# EAGLE design piezo-jfet-buffer-simple-2x (EAGLE 7.5.0)
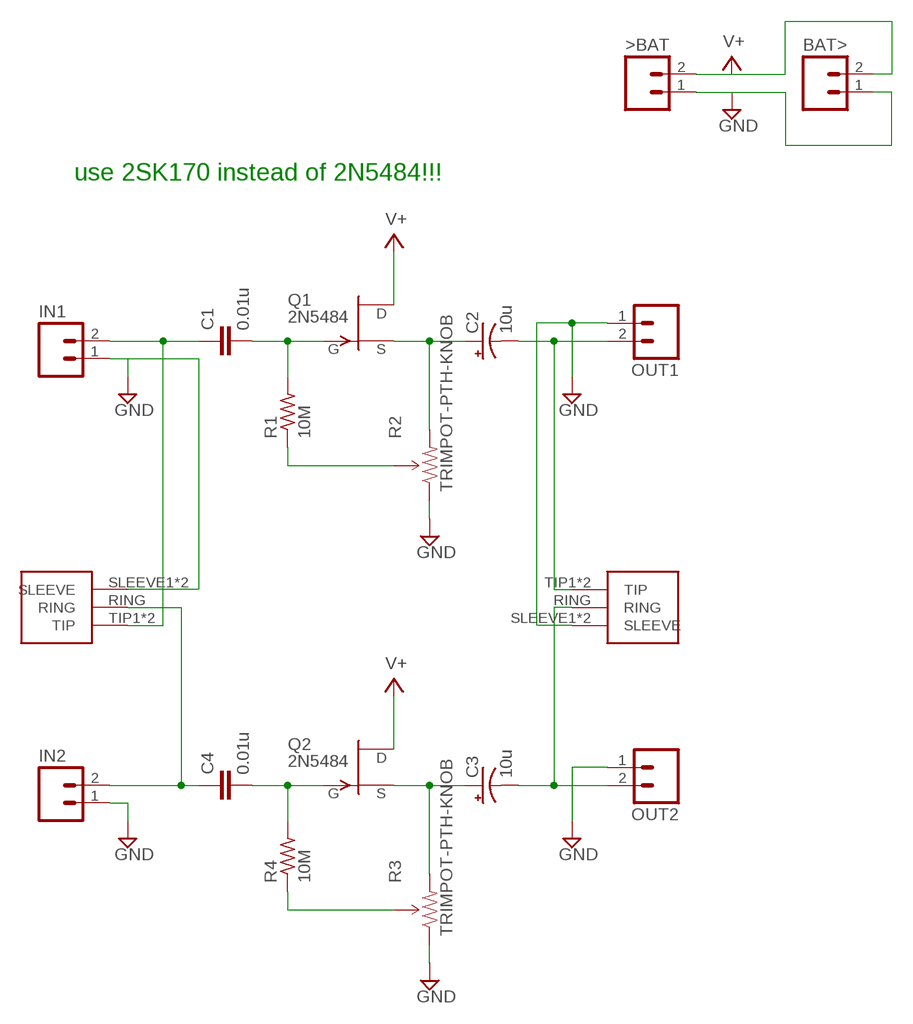
[diagram p0: schematic, sheet 1]

## Parts
>BAT  M02PTH  [1X02]
BAT>  M02PTH  [1X02]
C1  0.01u  C5/3  [C5B3]
C2  10u  CAP_POLPTH2  [CPOL-RADIAL-10UF-25V]
C3  10u  CAP_POLPTH2  [CPOL-RADIAL-10UF-25V]
C4  0.01u  C5/3  [C5B3]
IN1  M02LOCK  [1X02_LOCK]
IN2  M02LOCK  [1X02_LOCK]
OUT1  M02LOCK  [1X02_LOCK]
OUT2  M02LOCK  [1X02_LOCK]
Q1  2N5484  [TO92-]
Q2  2N5484  [TO92-]
R1  10M  R-US_0204/2V  [0204V]
R2  TRIMPOT-PTH-KNOB  [3386U]
R3  TRIMPOT-PTH-KNOB  [3386U]
R4  10M  R-US_0204/2V  [0204V]
U$1  1/8"-F-STEREO-PCB  [1/8"-F-STEREO-PCB]
U$2  1/8"-F-STEREO-PCB  [1/8"-F-STEREO-PCB]

## Nets
CH1: C2.2(-) OUT1.2 U$1.TIP1(TIP) U$1.TIP2(TIP)
CH2: C3.2(-) OUT2.2 U$1.RING
GND: >BAT.1 BAT>.1 IN1.1 IN2.1 OUT1.1 OUT2.1 R2.1(CCW) R3.1(CCW) U$1.SLEEVE1(SLEEVE) U$1.SLEEVE2(SLEEVE) U$2.SLEEVE1(SLEEVE) U$2.SLEEVE2(SLEEVE)
JFET-GATE: C1.2 Q1.1(G) R1.2
JFET-GATE1: C4.2 Q2.1(G) R4.2
JFET-SOURCE: C2.1(+) Q1.2(S) R2.3(CW)
JFET-SOURCE1: C3.1(+) Q2.2(S) R3.3(CW)
N$1: R3.2(WIPER) R4.1
N$2: C1.1 IN1.2 U$2.TIP1(TIP) U$2.TIP2(TIP)
N$3: R1.1 R2.2(WIPER)
N$4: C4.1 IN2.2 U$2.RING
V+: >BAT.2 BAT>.2 Q1.3(D) Q2.3(D)

## Notes on the sheet
- use 2SK170 instead of 2N5484!!!

## Library data of the parts
>BAT BAT> IN1 IN2 OUT1 OUT2 = SparkFun-Connectors:M02: Header 2 Standard 2-pin 0.1" header. Use with straight break away headers (SKU : PRT-00116), right angle break away headers (PRT-00553), swiss pins (PRT-00743), machine pins (PRT-00117), and female headers (PRT-00115). Molex polarized connector foot print use with SKU : PRT-08233 with associated crimp pins and housings.
C1 C4 = capacitor-wima:C: CAPACITOR naming: grid - package width
C2 C3 = SparkFun-Passives:CAP_POL: Capacitor Polarized These are standard SMD and PTH capacitors. Normally 10uF, 47uF, and 100uF in electrolytic and tantalum varieties. Always verify the external diameter of the through hole cap, it varies with capacity, voltage, and manufacturer. The EIA devices should be standard.
Q1 Q2 = transistor-fet:?548*: N-Channel JFETs Source: VISHAY 2N5484.pdf Compatible: TO92 2N5245 J304 J305 U310 J308 J309 J310 TO72 2N4416 2N4416A 2N3823 2N4351 3N169 3N170 3N171 MFE3002 TO18 2N3796 2N3797 MFE825 Source: Motorola European Master Guide Pacge 3-59
R1 R4 = resistor:R-US_: RESISTOR, American symbol
R2 R3 = SparkFun-Electromechanical:TRIMPOT: Various small potentiometers for "set-and-forget" applications
U$1 U$2 = CMU-ArtFab:1/8"-F-STEREO-PCB

## Board
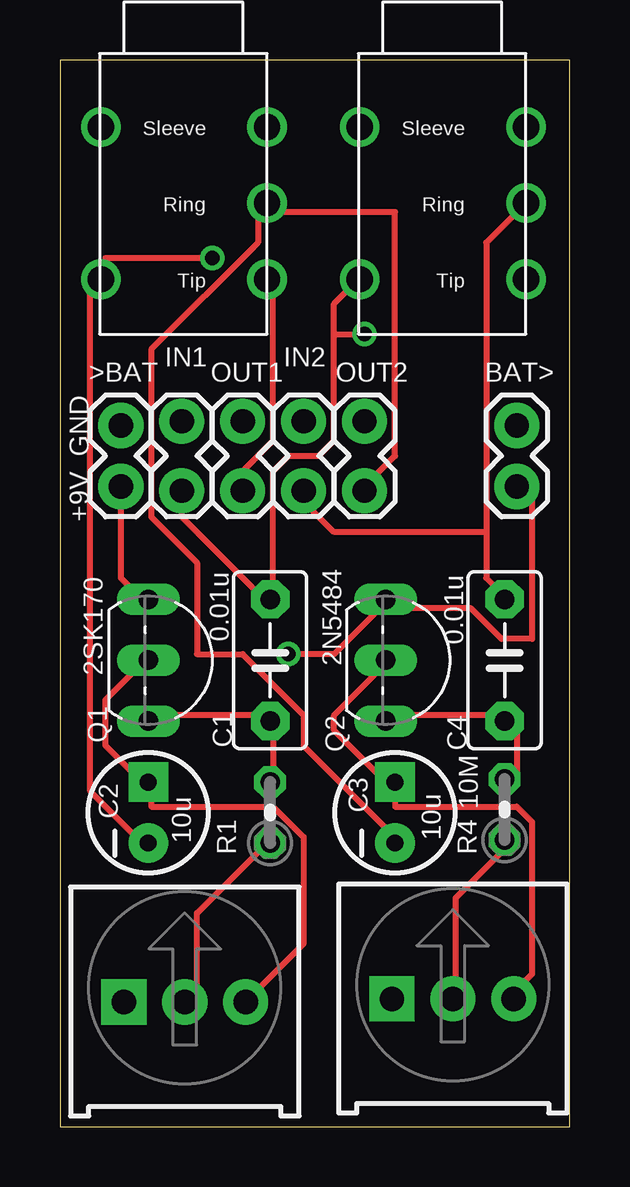
[diagram p1: board, top side]
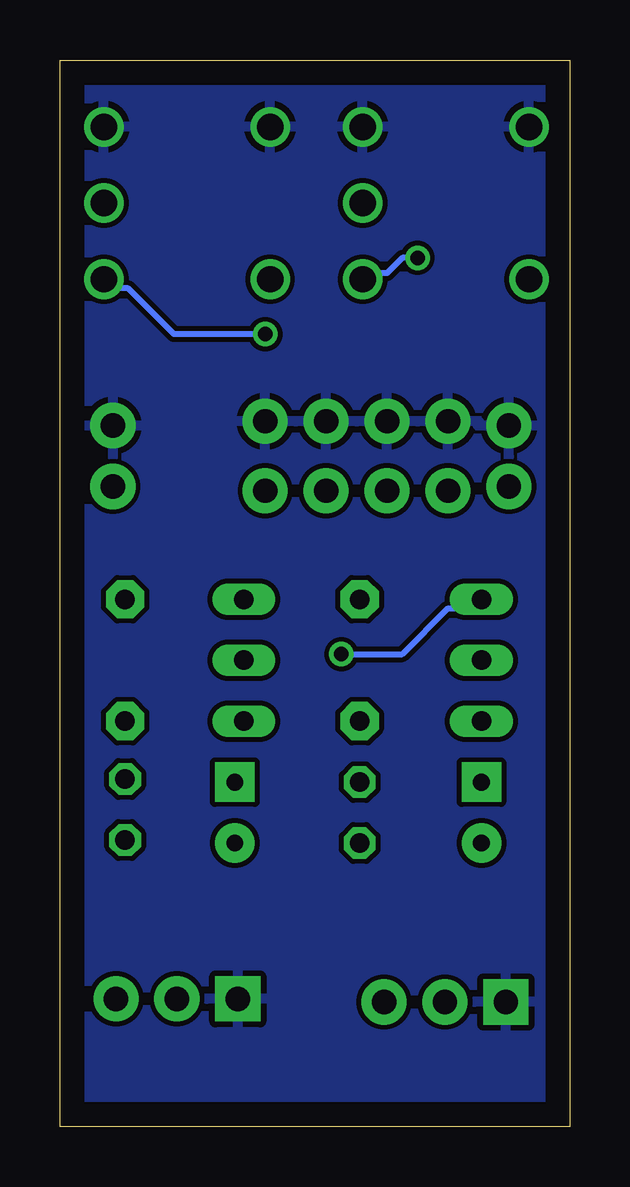
[diagram p2: board, bottom side, seen from below]

Size 21.26 x 44.44 mm. Coordinates in mm from the lower left corner, seen from the top.
Outline: 0,0 21.26,0 21.26,44.44 0,44.44 0,0
Copper layers (1*16): Top 0.035mm / dielectric 1.5mm / Bottom 0.035mm
Design rules "default": minimum track width 10mil, minimum drill 24mil, track to track 8mil, track to pad 8mil, pad to pad 8mil, via to via 8mil, smd to smd 8mil, copper to edge 40mil, drill to drill 8mil, minimum pad ring 10mil, minimum via ring 8mil, stop-mask expansion 4mil, vias tented up to drill 0mil, thermal gap 10mil

### Footprints (pad centres in the part's own frame; a part is rotated, then mirrored left to right if it is on the bottom)
1X02 = drill 1.016 pad 1.88: 1 0,0; 2 2.54,0
C5B3 = drill 0.813 pad 1.6 octagon: 1 -2.54,0; 2 2.54,0
CPOL-RADIAL-10UF-25V = drill 0.7 pad 1.651 square: 1 1.27,0 | drill 0.7 pad 1.651: 2 -1.27,0
1X02_LOCK = drill 1.016 pad 1.88: 1 -0.178,0; 2 2.718,0
TO92- = drill 0.813 long: 1 2.54,0; 2 0,0; 3 -2.54,0
0204V = drill 0.813 octagon: 1 -1.27,0; 2 1.27,0
3386U = drill 1.016 pad 1.88 square: 1 -2.54,-0.015 | drill 1.016 pad 1.88: 2 0,-0.015; 3 2.54,-0.015
1/8"-F-STEREO-PCB = drill 1.1: RING 5.461,0; SLEEVE1 8.636,6.934; SLEEVE2 8.636,0; TIP1 2.286,6.934; TIP2 2.286,0

### Placement (x,y rotation side)
>BAT  2.54,29.21 270 top
BAT>  19.05,29.21 270 top
C1  8.76,19.43 270 top
C2  3.68,13.08 90 top
C3  13.97,13.08 90 top
C4  18.54,19.43 270 top
IN1  5.08,29.21 270 top
IN2  10.16,29.21 270 top
OUT1  7.62,29.21 270 top
OUT2  12.7,29.21 270 top
Q1  3.68,19.43 270 top
Q2  13.59,19.43 270 top
R1  8.76,13.08 90 top
R2  5.21,5.21 0 top
R3  16.38,5.33 0 top
R4  18.54,13.21 90 top
U$1  8.64,33.02 90 top
U$2  19.43,33.02 90 top

### Tracks (layer width: path | path; a pad name or v marks a point on that pad's centre or on a via)
CH1  (via drill 0.61)
  Top 0.254: OUT1.2 7.62,27.3 8.89,28.57 8.89,34.92 U$1.TIP2 | C2.2 3.17,12.06 1.27,13.97 1.27,34.92 U$1.TIP1 1.91,35.56 1.91,36.2 v6.35,36.2
  Bottom 0.254: v6.35,36.2 6.99,36.2 7.62,35.56 8.26,35.56 U$1.TIP2
CH2
  Top 0.254: OUT2.2 12.7,26.67 13.97,27.94 13.97,38.1 8.89,38.1 U$1.RING 8.26,38.1 8.26,36.83 3.81,32.38 3.81,25.4 5.71,23.5 5.71,19.68 7.62,19.68 10.16,17.14 10.16,15.88 13.97,12.06 C3.2
GND
  pour Bottom: 0,44.45 21.59,44.45 21.59,0 0,0
JFET-GATE
  Top 0.254: Q1.1 3.81,17.14 8.26,17.14 C1.2 8.89,16.51 8.89,14.61 R1.2
JFET-GATE1
  Top 0.254: Q2.1 13.97,17.14 18.41,17.14 C4.2 19.05,16.51 19.05,14.61 R4.2
JFET-SOURCE
  Top 0.254: Q1.2 3.17,19.05 1.91,17.78 1.91,15.88 3.17,14.61 C2.1 3.81,13.97 3.81,13.34 8.89,13.34 10.16,12.06 10.16,7.62 8.26,5.71 R2.3
JFET-SOURCE1
  Top 0.254: 13.97,13.97 11.43,16.51 11.43,17.14 13.34,19.05 Q2.2 | 13.97,13.97 13.97,13.34 19.05,13.34 19.68,12.7 19.68,6.35 19.05,5.71 R3.3 | 13.97,13.97 C3.1
N$1
  Top 0.254: R4.1 18.41,11.43 16.51,9.53 16.51,5.71 R3.2
N$2  (via drill 0.61)
  Top 0.254: IN1.2 5.08,25.4 8.26,22.23 C1.1 8.89,22.23 8.89,27.3 9.53,27.94 10.79,27.94 11.43,28.57 11.43,33.02 | 11.43,33.02 11.43,34.29 12.06,34.92 U$2.TIP1 | 11.43,33.02 v12.7,33.02
  Bottom 0.254: v12.7,33.02 16.51,33.02 18.41,34.92 19.05,34.92 U$2.TIP2
N$3
  Top 0.254: R1.1 8.26,11.43 5.71,8.89 5.71,5.71 R2.2
N$4
  Top 0.254: 17.78,24.77 17.78,36.83 U$2.RING | 17.78,24.77 17.78,22.86 18.41,22.23 C4.1 | 17.78,24.77 11.43,24.77 10.16,26.04 IN2.2
V+  (via drill 0.61)
  Top 0.254: >BAT.2 2.54,22.86 3.17,22.23 Q1.3 | BAT>.2 19.68,26.04 19.68,20.32 18.41,20.32 17.14,21.59 13.97,21.59 Q2.3 13.34,21.59 11.43,19.68 v9.53,19.68
  Bottom 0.254: v9.53,19.68 6.99,19.68 5.08,21.59 3.81,21.59 Q1.3

### Text on the board
tNames: GND | +9V | 2SK170